# EasyEDA schematic schematic.json

## Sheets
1 power
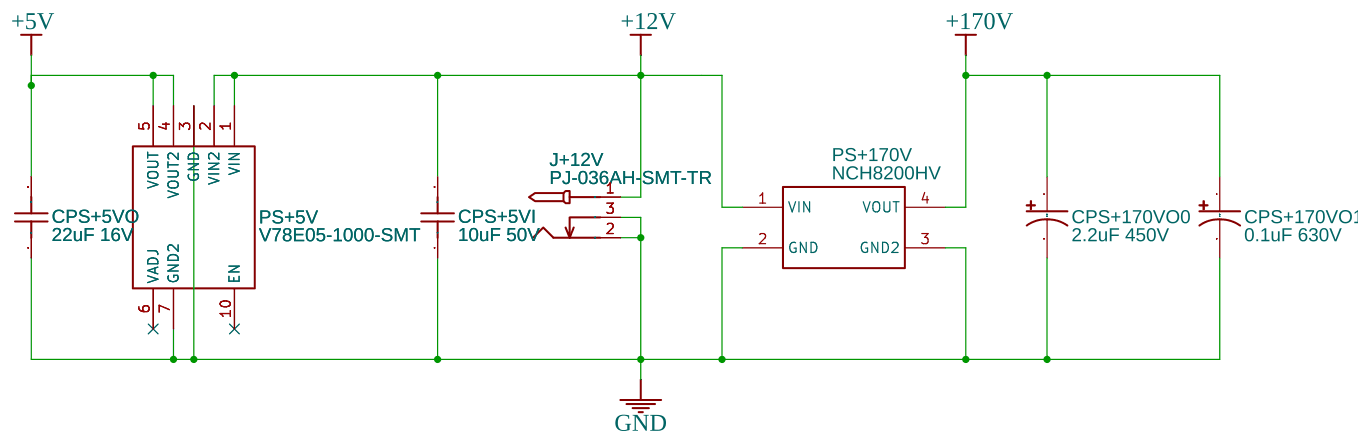
[diagram p0: power]
2 smarts
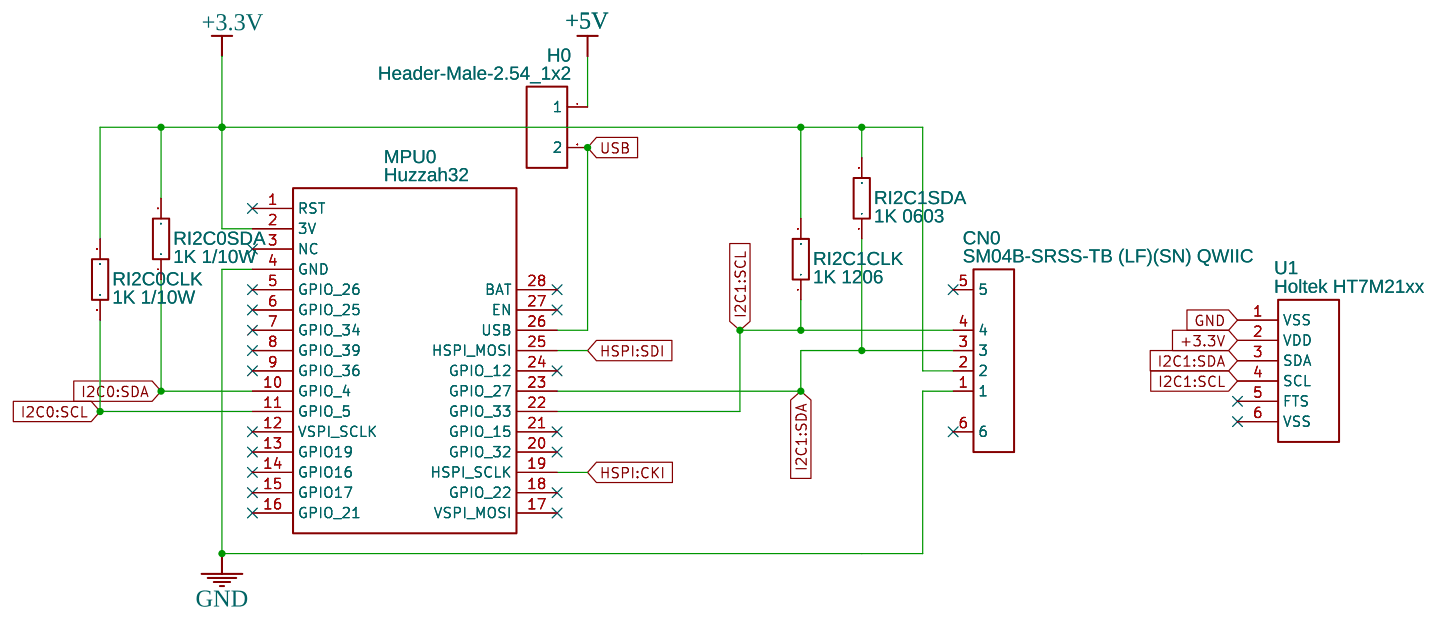
[diagram p1: smarts]
3 nixies
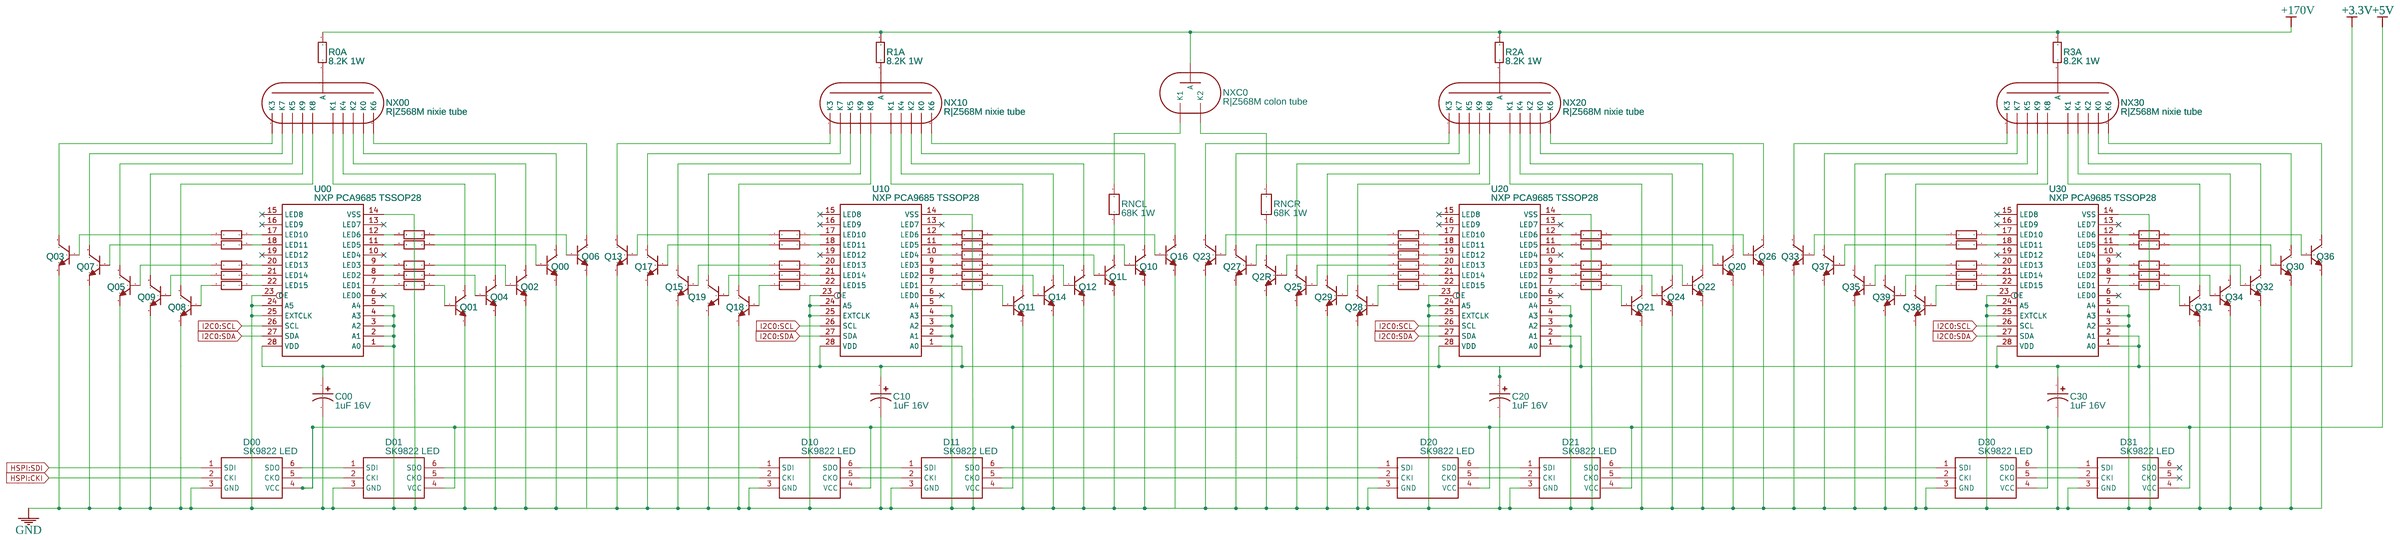
[diagram p2: nixies]

## Parts
sheet nixies
C00  1uF 16V  [C0603]
C10  1uF 16V  [C0603]
C20  1uF 16V  [C0603]
C30  1uF 16V  [C0603]
D00  SK9822 LED  [SK9822 LED]
D01  SK9822 LED  [SK9822 LED]
D10  SK9822 LED  [SK9822 LED]
D11  SK9822 LED  [SK9822 LED]
D20  SK9822 LED  [SK9822 LED]
D21  SK9822 LED  [SK9822 LED]
D30  SK9822 LED  [SK9822 LED]
D31  SK9822 LED  [SK9822 LED]
NX00  R|Z568M nixie tube  [R|Z568M NIXIE TUBE BOTTOM VIEW]
NX10  R|Z568M nixie tube  [R|Z568M NIXIE TUBE BOTTOM VIEW]
NX20  R|Z568M nixie tube  [R|Z568M NIXIE TUBE BOTTOM VIEW]
NX30  R|Z568M nixie tube  [R|Z568M NIXIE TUBE BOTTOM VIEW]
NXC0  R|Z568M colon tube  [R|Z568M COLON TUBE BOTTOM VIEW]
Q00  SMMBTA42LT1G  [SOT-23-3_L2.9-W1.6-P1.90-LS2.8-BR]
Q01  SMMBTA42LT1G  [SOT-23-3_L2.9-W1.6-P1.90-LS2.8-BR]
Q1L  SMMBTA42LT1G  [SOT-23-3_L2.9-W1.6-P1.90-LS2.8-BR]
Q02  SMMBTA42LT1G  [SOT-23-3_L2.9-W1.6-P1.90-LS2.8-BR]
Q2R  SMMBTA42LT1G  [SOT-23-3_L2.9-W1.6-P1.90-LS2.8-BR]
Q03  SMMBTA42LT1G  [SOT-23-3_L2.9-W1.6-P1.90-LS2.8-BR]
Q04  SMMBTA42LT1G  [SOT-23-3_L2.9-W1.6-P1.90-LS2.8-BR]
Q05  SMMBTA42LT1G  [SOT-23-3_L2.9-W1.6-P1.90-LS2.8-BR]
Q06  SMMBTA42LT1G  [SOT-23-3_L2.9-W1.6-P1.90-LS2.8-BR]
Q07  SMMBTA42LT1G  [SOT-23-3_L2.9-W1.6-P1.90-LS2.8-BR]
Q08  SMMBTA42LT1G  [SOT-23-3_L2.9-W1.6-P1.90-LS2.8-BR]
Q09  SMMBTA42LT1G  [SOT-23-3_L2.9-W1.6-P1.90-LS2.8-BR]
Q10  SMMBTA42LT1G  [SOT-23-3_L2.9-W1.6-P1.90-LS2.8-BR]
Q11  SMMBTA42LT1G  [SOT-23-3_L2.9-W1.6-P1.90-LS2.8-BR]
Q12  SMMBTA42LT1G  [SOT-23-3_L2.9-W1.6-P1.90-LS2.8-BR]
Q13  SMMBTA42LT1G  [SOT-23-3_L2.9-W1.6-P1.90-LS2.8-BR]
Q14  SMMBTA42LT1G  [SOT-23-3_L2.9-W1.6-P1.90-LS2.8-BR]
Q15  SMMBTA42LT1G  [SOT-23-3_L2.9-W1.6-P1.90-LS2.8-BR]
Q16  SMMBTA42LT1G  [SOT-23-3_L2.9-W1.6-P1.90-LS2.8-BR]
Q17  SMMBTA42LT1G  [SOT-23-3_L2.9-W1.6-P1.90-LS2.8-BR]
Q18  SMMBTA42LT1G  [SOT-23-3_L2.9-W1.6-P1.90-LS2.8-BR]
Q19  SMMBTA42LT1G  [SOT-23-3_L2.9-W1.6-P1.90-LS2.8-BR]
Q20  SMMBTA42LT1G  [SOT-23-3_L2.9-W1.6-P1.90-LS2.8-BR]
Q21  SMMBTA42LT1G  [SOT-23-3_L2.9-W1.6-P1.90-LS2.8-BR]
Q22  SMMBTA42LT1G  [SOT-23-3_L2.9-W1.6-P1.90-LS2.8-BR]
Q23  SMMBTA42LT1G  [SOT-23-3_L2.9-W1.6-P1.90-LS2.8-BR]
Q24  SMMBTA42LT1G  [SOT-23-3_L2.9-W1.6-P1.90-LS2.8-BR]
Q25  SMMBTA42LT1G  [SOT-23-3_L2.9-W1.6-P1.90-LS2.8-BR]
Q26  SMMBTA42LT1G  [SOT-23-3_L2.9-W1.6-P1.90-LS2.8-BR]
Q27  SMMBTA42LT1G  [SOT-23-3_L2.9-W1.6-P1.90-LS2.8-BR]
Q28  SMMBTA42LT1G  [SOT-23-3_L2.9-W1.6-P1.90-LS2.8-BR]
Q29  SMMBTA42LT1G  [SOT-23-3_L2.9-W1.6-P1.90-LS2.8-BR]
Q30  SMMBTA42LT1G  [SOT-23-3_L2.9-W1.6-P1.90-LS2.8-BR]
Q31  SMMBTA42LT1G  [SOT-23-3_L2.9-W1.6-P1.90-LS2.8-BR]
Q32  SMMBTA42LT1G  [SOT-23-3_L2.9-W1.6-P1.90-LS2.8-BR]
Q33  SMMBTA42LT1G  [SOT-23-3_L2.9-W1.6-P1.90-LS2.8-BR]
Q34  SMMBTA42LT1G  [SOT-23-3_L2.9-W1.6-P1.90-LS2.8-BR]
Q35  SMMBTA42LT1G  [SOT-23-3_L2.9-W1.6-P1.90-LS2.8-BR]
Q36  SMMBTA42LT1G  [SOT-23-3_L2.9-W1.6-P1.90-LS2.8-BR]
Q37  SMMBTA42LT1G  [SOT-23-3_L2.9-W1.6-P1.90-LS2.8-BR]
Q38  SMMBTA42LT1G  [SOT-23-3_L2.9-W1.6-P1.90-LS2.8-BR]
Q39  SMMBTA42LT1G  [SOT-23-3_L2.9-W1.6-P1.90-LS2.8-BR]
R00  1K 1/10W  [R0603]
R0A  8.2K 1W  [R2512]
R01  1K 1/10W  [R0603]
R1A  8.2K 1W  [R2512]
R1L  1K 1/10W  [R0603]
R02  1K 1/10W  [R0603]
R2A  8.2K 1W  [R2512]
R2R  1K 1/10W  [R0603]
R03  1K 1/10W  [R0603]
R3A  8.2K 1W  [R2512]
R04  1K 1/10W  [R0603]
R05  1K 1/10W  [R0603]
R06  1K 1/10W  [R0603]
R07  1K 1/10W  [R0603]
R08  1K 1/10W  [R0603]
R09  1K 1/10W  [R0603]
R10  1K 1/10W  [R0603]
R11  1K 1/10W  [R0603]
R12  1K 1/10W  [R0603]
R13  1K 1/10W  [R0603]
R14  1K 1/10W  [R0603]
R15  1K 1/10W  [R0603]
R16  1K 1/10W  [R0603]
R17  1K 1/10W  [R0603]
R18  1K 1/10W  [R0603]
R19  1K 1/10W  [R0603]
R20  1K 1/10W  [R0603]
R21  1K 1/10W  [R0603]
R22  1K 1/10W  [R0603]
R23  1K 1/10W  [R0603]
R24  1K 1/10W  [R0603]
R25  1K 1/10W  [R0603]
R26  1K 1/10W  [R0603]
R27  1K 1/10W  [R0603]
R28  1K 1/10W  [R0603]
R29  1K 1/10W  [R0603]
R30  1K 1/10W  [R0603]
R31  1K 1/10W  [R0603]
R32  1K 1/10W  [R0603]
R33  1K 1/10W  [R0603]
R34  1K 1/10W  [R0603]
R35  1K 1/10W  [R0603]
R36  1K 1/10W  [R0603]
R37  1K 1/10W  [R0603]
R38  1K 1/10W  [R0603]
R39  1K 1/10W  [R0603]
RNCL  68K 1W  [R2512]
RNCR  68K 1W  [R2512]
U00  NXP PCA9685 TSSOP28  [SOT361-1]
U10  NXP PCA9685 TSSOP28  [SOT361-1]
U20  NXP PCA9685 TSSOP28  [SOT361-1]
U30  NXP PCA9685 TSSOP28  [SOT361-1]
sheet power
CPS+5VI  10uF 50V  [C1210]
CPS+5VO  22uF 16V  [C1210]
CPS+170VO0  2.2uF 450V  [C2220]
CPS+170VO1  0.1uF 630V  [C1812]
J+12V  PJ-036AH-SMT-TR  [CUI PJ-036AH-SMT-TR]
PS+5V  V78E05-1000-SMT  [CUI V78E-1000-SMT]
PS+170V  NCH8200HV  [NCH8200HV SMD]
sheet smarts
CN0  SM04B-SRSS-TB (LF)(SN) QWIIC  [CONN-SMD_4P-P1.00_SM04B-SRSS-TB(LF)(SN)]
H0  Header-Male-2.54_1x2  [HARWIN M20-8890245]
MPU0  Huzzah32  [HUZZAH32 SMT]
RI2C0CLK  1K 1/10W  [R0603]
RI2C0SDA  1K 1/10W  [R0603]
RI2C1CLK  1K 1206  [R1206]
RI2C1SDA  1K 0603  [R0603]
U1  Holtek HT7M21xx  [PRECI-DIP 851-87-006-40-001101]

## Library data of the parts
C00 C10 C20 C30 = C_Tan_SMD_A_US: Supplier Part: 399-11133-1-ND; Supplier: Digi-Key; Contributor: LCEDA_Lib; Manufacturer Part: C0603C105K8RACTU; Manufacturer: KEMET; link: https://www.digikey.com/product-detail/en/kemet/C0603C105K8RACTU/399-11133-1-ND/4357815
D00 D01 D10 D11 D20 D21 D30 D31 = SK9822 LED: Manufacturer: Adafruit; Manufacturer Part: 2343; Supplier: Digi-Key; Supplier Part: 1528-1436-ND; Contributor: rossetyler; link: https://www.digikey.com/products/en?mpart=2343&v=1528
NX00 NX10 NX20 NX30 = R|Z568M nixie tube: Contributor: rossetyler; link: https://www.daliborfarny.com/product/rz568m-nixie-tube/
NXC0 = R|Z568M colon tube: Manufacturer: Dalibor Farny; Contributor: rossetyler; link: http://docs.daliborfarny.com/doc/separator-tube-rz568m/
Q00 Q01 Q1L Q02 Q2R Q03 Q04 Q05 Q06 Q07 Q08 Q09-Q39 = MMBTA42LT1G: Supplier: Digi-Key; Manufacturer: ON Semiconductor; Supplier Part: SMMBTA42LT1GOSCT-ND; link: https://www.digikey.com/product-detail/en/on-semiconductor/SMMBTA42LT1G/SMMBTA42LT1GOSCT-ND/8538921
R00 R01 R1L R02 R2R R03 R04 R05 R06 R07 R08 R09-R39 RI2C0CLK RI2C0SDA RI2C1SDA = CR0805-FX-1001ELF: Supplier: Digi-Key; Supplier Part: 541-1.00KHCT-ND; Manufacturer: Vishay Dale; Manufacturer Part: CRCW06031K00FKEA; Contributor: LCSC; link: https://www.digikey.com/product-detail/en/vishay-dale/CRCW06031K00FKEA/541-1-00KHCT-ND/1179809
R0A R1A R2A R3A = CR2512F8K2E04: Supplier: Digi-Key; Supplier Part: 541-8.2KXCT-ND; Manufacturer: Vishay Dale; Manufacturer Part: CRCW25128K20JNEG; Contributor: LCSC; link: https://www.digikey.com/product-detail/en/vishay-dale/CRCW25128K20JNEG/541-8-2KXCT-ND/1178603
RNCL RNCR = CR2512F68K0E04Z: Supplier: Digi-Key; Supplier Part: 541-68KXCT-ND; Manufacturer: Vishay Dale; Manufacturer Part: CRCW251268K0JNEG; Contributor: LCSC; link: https://www.digikey.com/product-detail/en/vishay-dale/CRCW251268K0JNEG/541-68KXCT-ND/1178625
U00 U10 U20 U30 = NXP PCA9685 TSSOP28: Manufacturer: NXP USA Inc.; Manufacturer Part: PCA9685PW/Q900,118; Supplier: Digi-Key; Supplier Part: 568-5931-1-ND; Contributor: rossetyler; link: https://www.digikey.com/product-detail/en/nxp-usa-inc/PCA9685PW-Q900-118/568-5931-1-ND/2531218
CPS+5VI = CL32Y106KBJ4PNE: Supplier: Digi-Key; Supplier Part: 399-11629-1-ND; Manufacturer: KEMET; Manufacturer Part: C1210C106K5RACTU; Contributor: LCSC; link: https://www.digikey.com/product-detail/en/kemet/C1210C106K5RACTU/399-11629-1-ND/4918885
CPS+5VO = CL32A226KOJNNWE: Supplier: Digi-Key; Supplier Part: 399-11662-1-ND; Manufacturer: KEMET; Manufacturer Part: C1210C226K4RAC7800; Contributor: LCSC; link: https://www.digikey.com/product-detail/en/kemet/C1210C226K4RAC7800/399-11662-1-ND/5023257
CPS+170VO0 = ULV2G100MNL1GS: Manufacturer: TDK Corporation; Manufacturer Part: C5750X6S2W225K250KA; Supplier: Digi-Key; Supplier Part: 445-7781-1-ND; Contributor: rossetyler; link: https://www.digikey.com/product-detail/en/tdk-corporation/C5750X6S2W225K250KA/445-7781-1-ND/2733853
CPS+170VO1 = ULV2G100MNL1GS: Manufacturer: TDK Corporation; Manufacturer Part: CGA8N4X7R2J104K230KA; Supplier: Digi-Key; Supplier Part: 445-7922-1-ND; Contributor: rossetyler; link: https://www.digikey.com/product-detail/en/tdk-corporation/CGA8N4X7R2J104K230KA/445-7922-1-ND/2781426
J+12V = DC005-2.0MM: Supplier: Digi-Key; Manufacturer: CUI; Supplier Part: CP-036AHPJCT-ND; link: https://www.digikey.com/product-detail/en/cui-devices/PJ-036AH-SMT-TR/CP-036AHPJCT-ND/1530994
PS+5V = V78E05-1000-SMT: Manufacturer: CUI; Supplier: Digi-Key; Supplier Part: 102-5033-1-ND; Contributor: rossetyler; link: https://www.digikey.com/product-detail/en/cui-inc/V78E05-1000-SMT-TR/102-5033-1-ND/9649684
PS+170V = NCH8200HV: Manufacturer: nixieclock.org; Supplier Part: B074S2T7X3; Supplier: Amazon; Contributor: rossetyler; link: https://www.amazon.com/%E3%80%90Genuine%E3%80%91NCH8200HV-Voltage-Module-Nixie-Clock/dp/B074S2T7X3
CN0 = SM04B-SRSS-TB (LF)(SN) QWIIC: Supplier: Digi-Key; Supplier Part: PRT-14417-ND; Manufacturer: SparkFun Electronics; Manufacturer Part: PRT-14417; Contributor: LCSC; link: https://www.digikey.com/product-detail/en/sparkfun-electronics/PRT-14417/PRT-14417-ND/7652746
H0 = Header-Male-2.54_1x2: Supplier: Digi-Key; Manufacturer: Harwin; Manufacturer Part: M20-8890245; image: https://cdn.harwin.com/images/M20-8890245_v1.jpg; Supplier Part: 952-3231-ND; link: https://www.digikey.com/product-detail/en/harwin-inc/M20-8890245/952-3231-ND/6565715
MPU0 = Huzzah32: Manufacturer: Adafruit; Manufacturer Part: 3405; Supplier: Digi-Key; Supplier Part: 1528-2181-ND; link: https://www.digikey.com/product-detail/en/adafruit-industries-llc/3405/1528-2181-ND/7244967; Contributor: rossetyler
RI2C1CLK = CR0805-FX-1001ELF: Supplier: Digi-Key; Supplier Part: RCL1.00KCCT-ND; Manufacturer: Vishay Dale; Manufacturer Part: RCL06121K00FKEA; Contributor: LCSC; link: https://www.digikey.com/product-detail/en/vishay-dale/CRCW06031K00FKEA/541-1-00KHCT-ND/1179809
U1 = Holtek HT7M21xx: Manufacturer: Holtek; Manufacturer Part: HT7M21xx; Supplier: Mouser; Supplier Part: HT7M21xx; link: https://www.holtek.com/documents/10179/116711/HT7M2126_27_36_56_76v140.pdf; Contributor: rossetyler

## Nets
+3.3V: C00.1 C10.1 C20.1 C30.1 CN0.2 MPU0.2(3V) RI2C0CLK.2 RI2C0SDA.2 RI2C1CLK.2 RI2C1SDA.2 U00.28(VDD) U1.2(VDD) U10.1(A0) U10.28(VDD) U20.2(A1) U20.28(VDD) U30.1(A0) U30.2(A1) U30.28(VDD)
+5V: CPS+5VO.2 D00.4(VCC) D01.4(VCC) D10.4(VCC) D11.4(VCC) D20.4(VCC) D21.4(VCC) D30.4(VCC) D31.4(VCC) H0.1 PS+5V.4(VOUT2) PS+5V.5(VOUT)
+12V: CPS+5VI.2 J+12V.1 PS+5V.1(VIN) PS+5V.2(VIN2) PS+170V.1(VIN)
+170V: CPS+170VO0.1 CPS+170VO1.1 NXC0.2(A) PS+170V.4(VOUT) R0A.2 R1A.2 R2A.2 R3A.2
GND: C00.2 C10.2 C20.2 C30.2 CN0.1 CPS+5VI.1 CPS+5VO.1 CPS+170VO0.2 CPS+170VO1.2 D00.3(GND) D01.3(GND) D10.3(GND) D11.3(GND) D20.3(GND) D21.3(GND) D30.3(GND) D31.3(GND) J+12V.2 J+12V.3 MPU0.4(GND) PS+5V.3(GND) PS+5V.7(GND2) PS+170V.2(GND) PS+170V.3(GND2) Q00.2 Q01.2 Q1L.2 Q02.2 Q2R.2 Q03.2 Q04.2 Q05.2 Q06.2 Q07.2 Q08.2 Q09.2 Q10.2 Q11.2 Q12.2 Q13.2 Q14.2 Q15.2 Q16.2 Q17.2 Q18.2 Q19.2 Q20.2 Q21.2 Q22.2 Q23.2 Q24.2 Q25.2 Q26.2 Q27.2 Q28.2 Q29.2 Q30.2 Q31.2 Q32.2 Q33.2 Q34.2 Q35.2 Q36.2 Q37.2 Q38.2 Q39.2 U00.1(A0) U00.2(A1) U00.3(A2) U00.4(A3) U00.5(A4) U00.14(VSS) U00.23(OE) U00.24(A5) U00.25(EXTCLK) U1.1(VSS) U10.2(A1) U10.3(A2) U10.4(A3) U10.5(A4) U10.14(VSS) U10.23(OE) U10.24(A5) U10.25(EXTCLK) U20.1(A0) U20.3(A2) U20.4(A3) U20.5(A4) U20.14(VSS) U20.23(OE) U20.24(A5) U20.25(EXTCLK) U30.3(A2) U30.4(A3) U30.5(A4) U30.14(VSS) U30.23(OE) U30.24(A5) U30.25(EXTCLK)
HSPI:CKI: D00.2(CKI) MPU0.19(HSPI SCLK)
HSPI:SDI: D00.1(SDI) MPU0.25(HSPI MOSI)
I2C0:SCL: MPU0.11(GPIO 5) RI2C0CLK.1 U00.26(SCL) U10.26(SCL) U20.26(SCL) U30.26(SCL)
I2C0:SDA: MPU0.10(GPIO 4) RI2C0SDA.1 U00.27(SDA) U10.27(SDA) U20.27(SDA) U30.27(SDA)
I2C1:SCL: CN0.4 MPU0.22(GPIO 33) RI2C1CLK.1 U1.4(SCL)
I2C1:SDA: CN0.3 MPU0.23(GPIO 27) RI2C1SDA.1 U1.3(SDA)
USB: H0.2 MPU0.26(USB)
Net-(D00-5): D00.5(CKO) D01.2(CKI)
Net-(D00-6): D00.6(SDO) D01.1(SDI)
Net-(D01-5): D01.5(CKO) D10.2(CKI)
Net-(D01-6): D01.6(SDO) D10.1(SDI)
Net-(D10-5): D10.5(CKO) D11.2(CKI)
Net-(D10-6): D10.6(SDO) D11.1(SDI)
Net-(D11-5): D11.5(CKO) D20.2(CKI)
Net-(D11-6): D11.6(SDO) D20.1(SDI)
Net-(D20-5): D20.5(CKO) D21.2(CKI)
Net-(D20-6): D20.6(SDO) D21.1(SDI)
Net-(D21-5): D21.5(CKO) D30.2(CKI)
Net-(D21-6): D21.6(SDO) D30.1(SDI)
Net-(D30-5): D30.5(CKO) D31.2(CKI)
Net-(D30-6): D30.6(SDO) D31.1(SDI)
Net-(NX00-1): NX00.1(K1) Q01.3
Net-(NX00-2): NX00.2(K4) Q04.3
Net-(NX00-3): NX00.3(K2) Q02.3
Net-(NX00-4): NX00.4(K0) Q00.3
Net-(NX00-5): NX00.5(K6) Q06.3
Net-(NX00-6): NX00.6(A) R0A.1
Net-(NX00-7): NX00.7(K3) Q03.3
Net-(NX00-8): NX00.8(K7) Q07.3
Net-(NX00-9): NX00.9(K5) Q05.3
Net-(NX00-10): NX00.10(K9) Q09.3
Net-(NX00-11): NX00.11(K8) Q08.3
Net-(NX10-1): NX10.1(K1) Q11.3
Net-(NX10-2): NX10.2(K4) Q14.3
Net-(NX10-3): NX10.3(K2) Q12.3
Net-(NX10-4): NX10.4(K0) Q10.3
Net-(NX10-5): NX10.5(K6) Q16.3
Net-(NX10-6): NX10.6(A) R1A.1
Net-(NX10-7): NX10.7(K3) Q13.3
Net-(NX10-8): NX10.8(K7) Q17.3
Net-(NX10-9): NX10.9(K5) Q15.3
Net-(NX10-10): NX10.10(K9) Q19.3
Net-(NX10-11): NX10.11(K8) Q18.3
Net-(NX20-1): NX20.1(K1) Q21.3
Net-(NX20-2): NX20.2(K4) Q24.3
Net-(NX20-3): NX20.3(K2) Q22.3
Net-(NX20-4): NX20.4(K0) Q20.3
Net-(NX20-5): NX20.5(K6) Q26.3
Net-(NX20-6): NX20.6(A) R2A.1
Net-(NX20-7): NX20.7(K3) Q23.3
Net-(NX20-8): NX20.8(K7) Q27.3
Net-(NX20-9): NX20.9(K5) Q25.3
Net-(NX20-10): NX20.10(K9) Q29.3
Net-(NX20-11): NX20.11(K8) Q28.3
Net-(NX30-1): NX30.1(K1) Q31.3
Net-(NX30-2): NX30.2(K4) Q34.3
Net-(NX30-3): NX30.3(K2) Q32.3
Net-(NX30-4): NX30.4(K0) Q30.3
Net-(NX30-5): NX30.5(K6) Q36.3
Net-(NX30-6): NX30.6(A) R3A.1
Net-(NX30-7): NX30.7(K3) Q33.3
Net-(NX30-8): NX30.8(K7) Q37.3
Net-(NX30-9): NX30.9(K5) Q35.3
Net-(NX30-10): NX30.10(K9) Q39.3
Net-(NX30-11): NX30.11(K8) Q38.3
Net-(NXC0-1): NXC0.1(K2) RNCR.2
Net-(NXC0-3): NXC0.3(K1) RNCL.2
Net-(Q00-1): Q00.1 R00.1
Net-(Q01-1): Q01.1 R01.1
Net-(Q1L-1): Q1L.1 R1L.1
Net-(Q1L-3): Q1L.3 RNCL.1
Net-(Q02-1): Q02.1 R02.1
Net-(Q2R-1): Q2R.1 R2R.2
Net-(Q2R-3): Q2R.3 RNCR.1
Net-(Q03-1): Q03.1 R03.2
Net-(Q04-1): Q04.1 R04.1
Net-(Q05-1): Q05.1 R05.2
Net-(Q06-1): Q06.1 R06.1
Net-(Q07-1): Q07.1 R07.2
Net-(Q08-1): Q08.1 R08.2
Net-(Q09-1): Q09.1 R09.2
Net-(Q10-1): Q10.1 R10.1
Net-(Q11-1): Q11.1 R11.1
Net-(Q12-1): Q12.1 R12.1
Net-(Q13-1): Q13.1 R13.2
Net-(Q14-1): Q14.1 R14.1
Net-(Q15-1): Q15.1 R15.2
Net-(Q16-1): Q16.1 R16.1
Net-(Q17-1): Q17.1 R17.2
Net-(Q18-1): Q18.1 R18.2
Net-(Q19-1): Q19.1 R19.2
Net-(Q20-1): Q20.1 R20.1
Net-(Q21-1): Q21.1 R21.1
Net-(Q22-1): Q22.1 R22.1
Net-(Q23-1): Q23.1 R23.2
Net-(Q24-1): Q24.1 R24.1
Net-(Q25-1): Q25.1 R25.2
Net-(Q26-1): Q26.1 R26.1
Net-(Q27-1): Q27.1 R27.2
Net-(Q28-1): Q28.1 R28.2
Net-(Q29-1): Q29.1 R29.2
Net-(Q30-1): Q30.1 R30.1
Net-(Q31-1): Q31.1 R31.1
Net-(Q32-1): Q32.1 R32.1
Net-(Q33-1): Q33.1 R33.2
Net-(Q34-1): Q34.1 R34.1
Net-(Q35-1): Q35.1 R35.2
Net-(Q36-1): Q36.1 R36.1
Net-(Q37-1): Q37.1 R37.2
Net-(Q38-1): Q38.1 R38.2
Net-(Q39-1): Q39.1 R39.2
Net-(R00-2): R00.2 U00.11(LED5)
Net-(R01-2): R01.2 U00.7(LED1)
Net-(R1L-2): R1L.2 U10.10(LED4)
Net-(R02-2): R02.2 U00.9(LED3)
Net-(R2R-1): R2R.1 U20.19(LED12)
Net-(R03-1): R03.1 U00.17(LED10)
Net-(R04-2): R04.2 U00.8(LED2)
Net-(R05-1): R05.1 U00.20(LED13)
Net-(R06-2): R06.2 U00.12(LED6)
Net-(R07-1): R07.1 U00.18(LED11)
Net-(R08-1): R08.1 U00.22(LED15)
Net-(R09-1): R09.1 U00.21(LED14)
Net-(R10-2): R10.2 U10.11(LED5)
Net-(R11-2): R11.2 U10.7(LED1)
Net-(R12-2): R12.2 U10.9(LED3)
Net-(R13-1): R13.1 U10.17(LED10)
Net-(R14-2): R14.2 U10.8(LED2)
Net-(R15-1): R15.1 U10.20(LED13)
Net-(R16-2): R16.2 U10.12(LED6)
Net-(R17-1): R17.1 U10.18(LED11)
Net-(R18-1): R18.1 U10.22(LED15)
Net-(R19-1): R19.1 U10.21(LED14)
Net-(R20-2): R20.2 U20.11(LED5)
Net-(R21-2): R21.2 U20.7(LED1)
Net-(R22-2): R22.2 U20.9(LED3)
Net-(R23-1): R23.1 U20.17(LED10)
Net-(R24-2): R24.2 U20.8(LED2)
Net-(R25-1): R25.1 U20.20(LED13)
Net-(R26-2): R26.2 U20.12(LED6)
Net-(R27-1): R27.1 U20.18(LED11)
Net-(R28-1): R28.1 U20.22(LED15)
Net-(R29-1): R29.1 U20.21(LED14)
Net-(R30-2): R30.2 U30.11(LED5)
Net-(R31-2): R31.2 U30.7(LED1)
Net-(R32-2): R32.2 U30.9(LED3)
Net-(R33-1): R33.1 U30.17(LED10)
Net-(R34-2): R34.2 U30.8(LED2)
Net-(R35-1): R35.1 U30.20(LED13)
Net-(R36-2): R36.2 U30.12(LED6)
Net-(R37-1): R37.1 U30.18(LED11)
Net-(R38-1): R38.1 U30.22(LED15)
Net-(R39-1): R39.1 U30.21(LED14)

Not connected (* = marked no-connect by the designer): CN0 5* 6*; D31 5(CKO)* 6(SDO)*; MPU0 1(RST)* 3(NC)* 5(GPIO 26)* 6(GPIO 25)* 7(GPIO 34)* 8(GPIO 39)* 9(GPIO 36)* 12(VSPI SCLK)* 13(GPIO19)* 14(GPIO16)* 15(GPIO17)* 16(GPIO 21)* 17(VSPI MOSI)* 18(GPIO 22)* 20(GPIO 32)* 21(GPIO 15)* 24(GPIO 12)* 27(EN)* 28(BAT)*; PS+5V 6(VADJ)* 10(EN)*; U00 6(LED0)* 10(LED4)* 13(LED7)* 15(LED8)* 16(LED9)* 19(LED12)*; U1 5(FTS)* 6(VSS)*; U10 6(LED0)* 13(LED7)* 15(LED8)* 16(LED9)* 19(LED12)*; U20 6(LED0)* 10(LED4)* 13(LED7)* 15(LED8)* 16(LED9)*; U30 6(LED0)* 10(LED4)* 13(LED7)* 15(LED8)* 16(LED9)* 19(LED12)*
